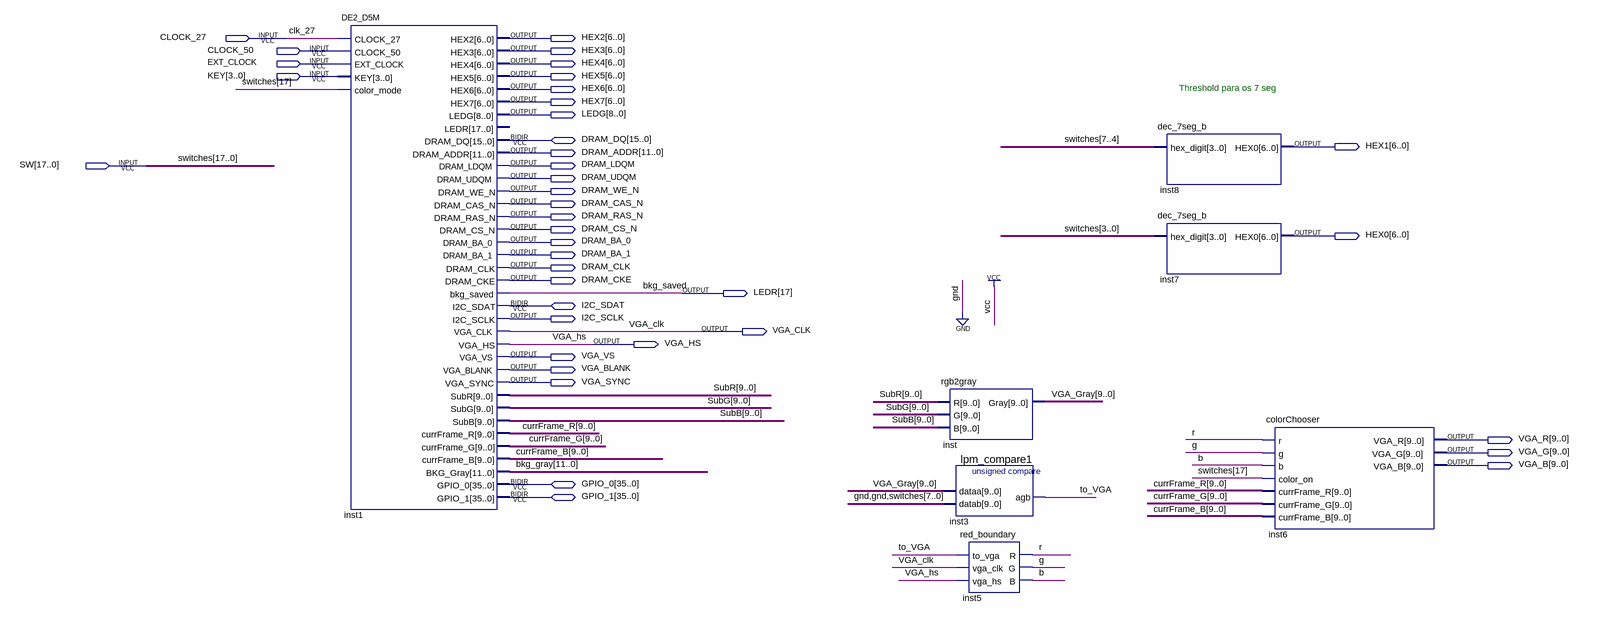
[diagram p0: schematic sheet]
// Quartus schematic main.bdf as structural Verilog: 7 symbols, 39 pins
module main (
  input  CLOCK_27,
  input  CLOCK_50,
  input  EXT_CLOCK,
  input  [3:0] KEY,
  input  [17:0] SW,
  inout  [15:0] DRAM_DQ,
  inout  I2C_SDAT,
  inout  [35:0] GPIO_0,
  inout  [35:0] GPIO_1,
  output [6:0] HEX2,
  output [6:0] HEX3,
  output [6:0] HEX4,
  output [6:0] HEX5,
  output [6:0] HEX6,
  output [6:0] HEX7,
  output [8:0] LEDG,
  output [6:0] HEX1,
  output [11:0] DRAM_ADDR,
  output DRAM_LDQM,
  output DRAM_UDQM,
  output DRAM_WE_N,
  output DRAM_CAS_N,
  output DRAM_RAS_N,
  output DRAM_CS_N,
  output [6:0] HEX0,
  output DRAM_BA_0,
  output DRAM_BA_1,
  output DRAM_CLK,
  output DRAM_CKE,
  output [17:17] LEDR,
  output I2C_SCLK,
  output VGA_CLK,
  output VGA_HS,
  output VGA_VS,
  output VGA_BLANK,
  output VGA_SYNC,
  output [9:0] VGA_R,
  output [9:0] VGA_G,
  output [9:0] VGA_B
);

  wire b, g, r, to_VGA;
  wire [9:0] currFrame_B, currFrame_G, currFrame_R, SubB, SubG, SubR, VGA_Gray;
  wire [11:0] bkg_gray;

  DE2_D5M inst1 (
    .CLOCK_27(CLOCK_27), .CLOCK_50(CLOCK_50), .EXT_CLOCK(EXT_CLOCK), .KEY(KEY), .color_mode(SW[17]),
    .HEX2(HEX2), .HEX3(HEX3), .HEX4(HEX4), .HEX5(HEX5), .HEX6(HEX6), .HEX7(HEX7), .LEDG(LEDG),
    .DRAM_ADDR(DRAM_ADDR), .DRAM_LDQM(DRAM_LDQM), .DRAM_UDQM(DRAM_UDQM), .DRAM_WE_N(DRAM_WE_N),
    .DRAM_CAS_N(DRAM_CAS_N), .DRAM_RAS_N(DRAM_RAS_N), .DRAM_CS_N(DRAM_CS_N), .DRAM_BA_0(DRAM_BA_0),
    .DRAM_BA_1(DRAM_BA_1), .DRAM_CLK(DRAM_CLK), .DRAM_CKE(DRAM_CKE), .bkg_saved(LEDR[17]),
    .I2C_SCLK(I2C_SCLK), .VGA_CLK(VGA_CLK), .VGA_HS(VGA_HS), .VGA_VS(VGA_VS), .VGA_BLANK(VGA_BLANK),
    .VGA_SYNC(VGA_SYNC), .SubR(SubR), .SubG(SubG), .SubB(SubB), .currFrame_R(currFrame_R),
    .currFrame_G(currFrame_G), .currFrame_B(currFrame_B), .BKG_Gray(bkg_gray), .DRAM_DQ(DRAM_DQ),
    .I2C_SDAT(I2C_SDAT), .GPIO_0(GPIO_0), .GPIO_1(GPIO_1));  // open: LEDR
  rgb2gray inst (.R(SubR), .G(SubG), .B(SubB), .Gray(VGA_Gray));
  lpm_compare1 inst3 (.dataa(VGA_Gray), .datab({2'b00, SW[7:0]}), .agb(to_VGA));
  red_boundary inst5 (.to_vga(to_VGA), .vga_clk(VGA_CLK), .vga_hs(VGA_HS), .R(r), .G(g), .B(b));
  dec_7seg_b inst8 (.hex_digit(SW[7:4]), .HEX0(HEX1));
  dec_7seg_b inst7 (.hex_digit(SW[3:0]), .HEX0(HEX0));
  colorChooser inst6 (
    .r(r), .g(g), .b(b), .color_on(SW[17]), .currFrame_R(currFrame_R), .currFrame_G(currFrame_G),
    .currFrame_B(currFrame_B), .VGA_R(VGA_R), .VGA_G(VGA_G), .VGA_B(VGA_B));

  // Other names for the same wires on the sheet: bkg_saved = LEDR[17]; clk_27 = CLOCK_27; switches[17:0] = SW

  // Notes on the sheet:
  //   Threshold para os 7 seg
endmodule
